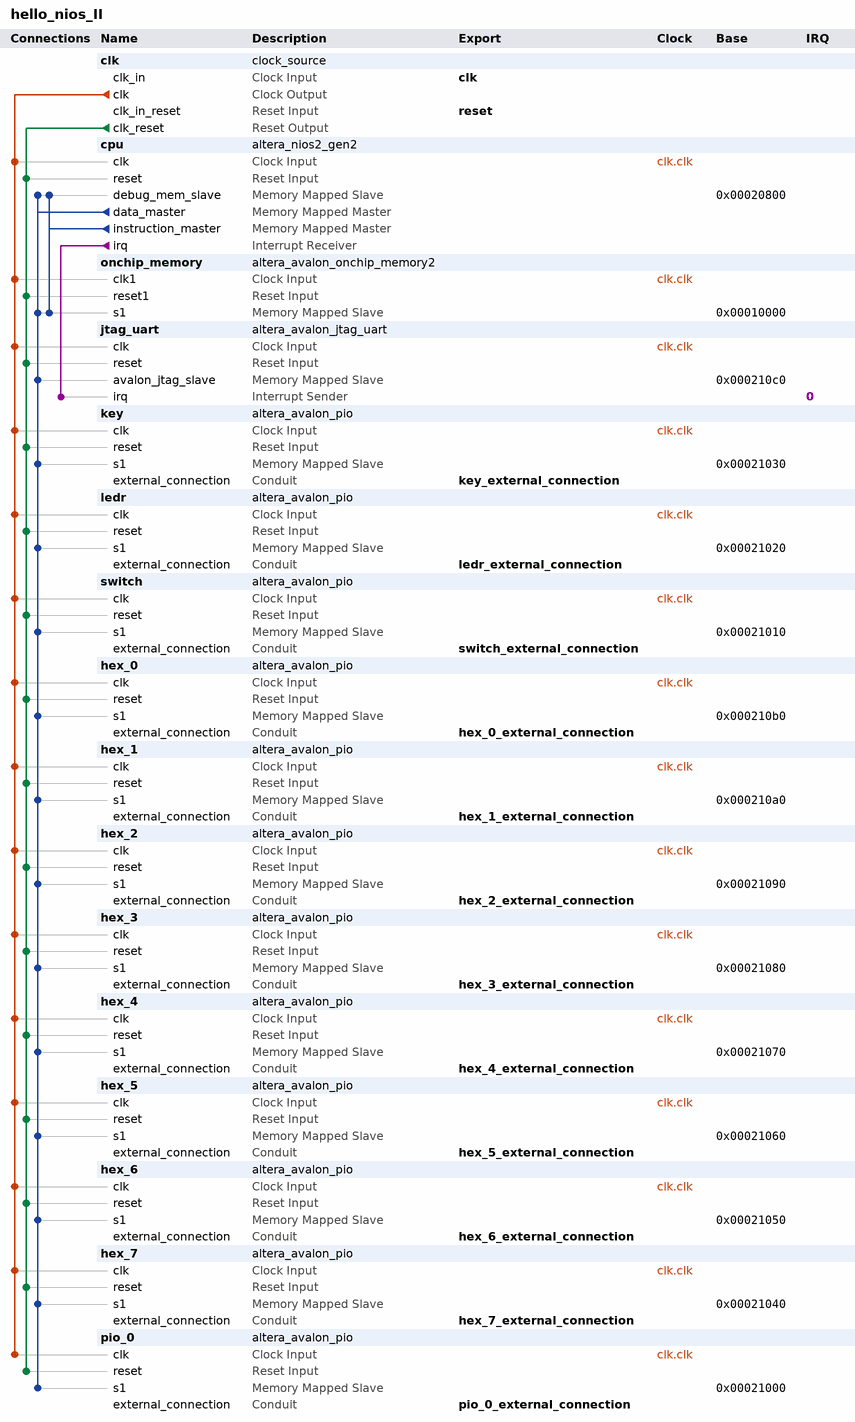
[diagram p0: system contents]
# Platform Designer (Qsys) system hello_nios_II, Cyclone IV E EP4CE115F29C7
# Parameters at their usual value, and those the tool derives, are not listed.
package require -exact qsys 18.1
create_system hello_nios_II
set_project_property DEVICE_FAMILY {Cyclone IV E}
set_project_property DEVICE EP4CE115F29C7

add_instance clk clock_source 18.1
set_instance_parameter_value clk clockFrequency 50000000

add_instance cpu altera_nios2_gen2 18.1
set_instance_parameter_value cpu dcache_size 2048
set_instance_parameter_value cpu exceptionSlave onchip_memory.s1
set_instance_parameter_value cpu icache_size 4096
set_instance_parameter_value cpu impl Tiny
set_instance_parameter_value cpu resetSlave onchip_memory.s1

add_instance onchip_memory altera_avalon_onchip_memory2 18.1
set_instance_parameter_value onchip_memory dataWidth 32
set_instance_parameter_value onchip_memory dualPort false
set_instance_parameter_value onchip_memory initMemContent false
set_instance_parameter_value onchip_memory initializationFileName onchip_mem.hex
set_instance_parameter_value onchip_memory memorySize 65536

add_instance jtag_uart altera_avalon_jtag_uart 18.1
set_instance_parameter_value jtag_uart simInteractiveOptions NO_INTERACTIVE_WINDOWS

add_instance key altera_avalon_pio 18.1
set_instance_parameter_value key direction Input
set_instance_parameter_value key width 4

add_instance ledr altera_avalon_pio 18.1
set_instance_parameter_value ledr direction Output
set_instance_parameter_value ledr width 18

add_instance switch altera_avalon_pio 18.1
set_instance_parameter_value switch direction Input
set_instance_parameter_value switch width 18

add_instance hex_0 altera_avalon_pio 18.1
set_instance_parameter_value hex_0 direction Output
set_instance_parameter_value hex_0 width 7

add_instance hex_1 altera_avalon_pio 18.1
set_instance_parameter_value hex_1 direction Output
set_instance_parameter_value hex_1 width 7

add_instance hex_2 altera_avalon_pio 18.1
set_instance_parameter_value hex_2 direction Output
set_instance_parameter_value hex_2 width 7

add_instance hex_3 altera_avalon_pio 18.1
set_instance_parameter_value hex_3 direction Output
set_instance_parameter_value hex_3 width 7

add_instance hex_4 altera_avalon_pio 18.1
set_instance_parameter_value hex_4 direction Output
set_instance_parameter_value hex_4 width 7

add_instance hex_5 altera_avalon_pio 18.1
set_instance_parameter_value hex_5 direction Output
set_instance_parameter_value hex_5 width 7

add_instance hex_6 altera_avalon_pio 18.1
set_instance_parameter_value hex_6 direction Output
set_instance_parameter_value hex_6 width 7

add_instance hex_7 altera_avalon_pio 18.1
set_instance_parameter_value hex_7 direction Output
set_instance_parameter_value hex_7 width 7

add_instance pio_0 altera_avalon_pio 18.1
set_instance_parameter_value pio_0 direction Input
set_instance_parameter_value pio_0 width 4

# connections
add_connection clk.clk cpu.clk clock
add_connection clk.clk hex_0.clk clock
add_connection clk.clk hex_1.clk clock
add_connection clk.clk hex_2.clk clock
add_connection clk.clk hex_3.clk clock
add_connection clk.clk hex_4.clk clock
add_connection clk.clk hex_5.clk clock
add_connection clk.clk hex_6.clk clock
add_connection clk.clk hex_7.clk clock
add_connection clk.clk jtag_uart.clk clock
add_connection clk.clk key.clk clock
add_connection clk.clk ledr.clk clock
add_connection clk.clk onchip_memory.clk1 clock
add_connection clk.clk pio_0.clk clock
add_connection clk.clk switch.clk clock
add_connection clk.clk_reset cpu.reset reset
add_connection clk.clk_reset hex_0.reset reset
add_connection clk.clk_reset hex_1.reset reset
add_connection clk.clk_reset hex_2.reset reset
add_connection clk.clk_reset hex_3.reset reset
add_connection clk.clk_reset hex_4.reset reset
add_connection clk.clk_reset hex_5.reset reset
add_connection clk.clk_reset hex_6.reset reset
add_connection clk.clk_reset hex_7.reset reset
add_connection clk.clk_reset jtag_uart.reset reset
add_connection clk.clk_reset key.reset reset
add_connection clk.clk_reset ledr.reset reset
add_connection clk.clk_reset onchip_memory.reset1 reset
add_connection clk.clk_reset pio_0.reset reset
add_connection clk.clk_reset switch.reset reset
add_connection cpu.data_master cpu.debug_mem_slave avalon
set_connection_parameter_value cpu.data_master/cpu.debug_mem_slave baseAddress 0x00020800
add_connection cpu.data_master hex_0.s1 avalon
set_connection_parameter_value cpu.data_master/hex_0.s1 baseAddress 0x000210b0
add_connection cpu.data_master hex_1.s1 avalon
set_connection_parameter_value cpu.data_master/hex_1.s1 baseAddress 0x000210a0
add_connection cpu.data_master hex_2.s1 avalon
set_connection_parameter_value cpu.data_master/hex_2.s1 baseAddress 0x00021090
add_connection cpu.data_master hex_3.s1 avalon
set_connection_parameter_value cpu.data_master/hex_3.s1 baseAddress 0x00021080
add_connection cpu.data_master hex_4.s1 avalon
set_connection_parameter_value cpu.data_master/hex_4.s1 baseAddress 0x00021070
add_connection cpu.data_master hex_5.s1 avalon
set_connection_parameter_value cpu.data_master/hex_5.s1 baseAddress 0x00021060
add_connection cpu.data_master hex_6.s1 avalon
set_connection_parameter_value cpu.data_master/hex_6.s1 baseAddress 0x00021050
add_connection cpu.data_master hex_7.s1 avalon
set_connection_parameter_value cpu.data_master/hex_7.s1 baseAddress 0x00021040
add_connection cpu.data_master jtag_uart.avalon_jtag_slave avalon
set_connection_parameter_value cpu.data_master/jtag_uart.avalon_jtag_slave baseAddress 0x000210c0
add_connection cpu.data_master key.s1 avalon
set_connection_parameter_value cpu.data_master/key.s1 baseAddress 0x00021030
add_connection cpu.data_master ledr.s1 avalon
set_connection_parameter_value cpu.data_master/ledr.s1 baseAddress 0x00021020
add_connection cpu.data_master onchip_memory.s1 avalon
set_connection_parameter_value cpu.data_master/onchip_memory.s1 baseAddress 0x00010000
add_connection cpu.data_master pio_0.s1 avalon
set_connection_parameter_value cpu.data_master/pio_0.s1 baseAddress 0x00021000
add_connection cpu.data_master switch.s1 avalon
set_connection_parameter_value cpu.data_master/switch.s1 baseAddress 0x00021010
add_connection cpu.instruction_master cpu.debug_mem_slave avalon
set_connection_parameter_value cpu.instruction_master/cpu.debug_mem_slave baseAddress 0x00020800
add_connection cpu.instruction_master onchip_memory.s1 avalon
set_connection_parameter_value cpu.instruction_master/onchip_memory.s1 baseAddress 0x00010000
add_connection cpu.irq jtag_uart.irq interrupt
set_connection_parameter_value cpu.irq/jtag_uart.irq irqNumber 0

# exported interfaces
add_interface clk clock sink
set_interface_property clk EXPORT_OF clk.clk_in
add_interface hex_0_external_connection conduit end
set_interface_property hex_0_external_connection EXPORT_OF hex_0.external_connection
add_interface hex_1_external_connection conduit end
set_interface_property hex_1_external_connection EXPORT_OF hex_1.external_connection
add_interface hex_2_external_connection conduit end
set_interface_property hex_2_external_connection EXPORT_OF hex_2.external_connection
add_interface hex_3_external_connection conduit end
set_interface_property hex_3_external_connection EXPORT_OF hex_3.external_connection
add_interface hex_4_external_connection conduit end
set_interface_property hex_4_external_connection EXPORT_OF hex_4.external_connection
add_interface hex_5_external_connection conduit end
set_interface_property hex_5_external_connection EXPORT_OF hex_5.external_connection
add_interface hex_6_external_connection conduit end
set_interface_property hex_6_external_connection EXPORT_OF hex_6.external_connection
add_interface hex_7_external_connection conduit end
set_interface_property hex_7_external_connection EXPORT_OF hex_7.external_connection
add_interface key_external_connection conduit end
set_interface_property key_external_connection EXPORT_OF key.external_connection
add_interface ledr_external_connection conduit end
set_interface_property ledr_external_connection EXPORT_OF ledr.external_connection
add_interface pio_0_external_connection conduit end
set_interface_property pio_0_external_connection EXPORT_OF pio_0.external_connection
add_interface reset reset sink
set_interface_property reset EXPORT_OF clk.clk_in_reset
add_interface switch_external_connection conduit end
set_interface_property switch_external_connection EXPORT_OF switch.external_connection

set_interconnect_requirement {$system} qsys_mm.clockCrossingAdapter HANDSHAKE
set_interconnect_requirement {$system} qsys_mm.enableEccProtection FALSE
set_interconnect_requirement {$system} qsys_mm.insertDefaultSlave FALSE
set_interconnect_requirement {$system} qsys_mm.maxAdditionalLatency 1

save_system hello_nios_II.qsys
